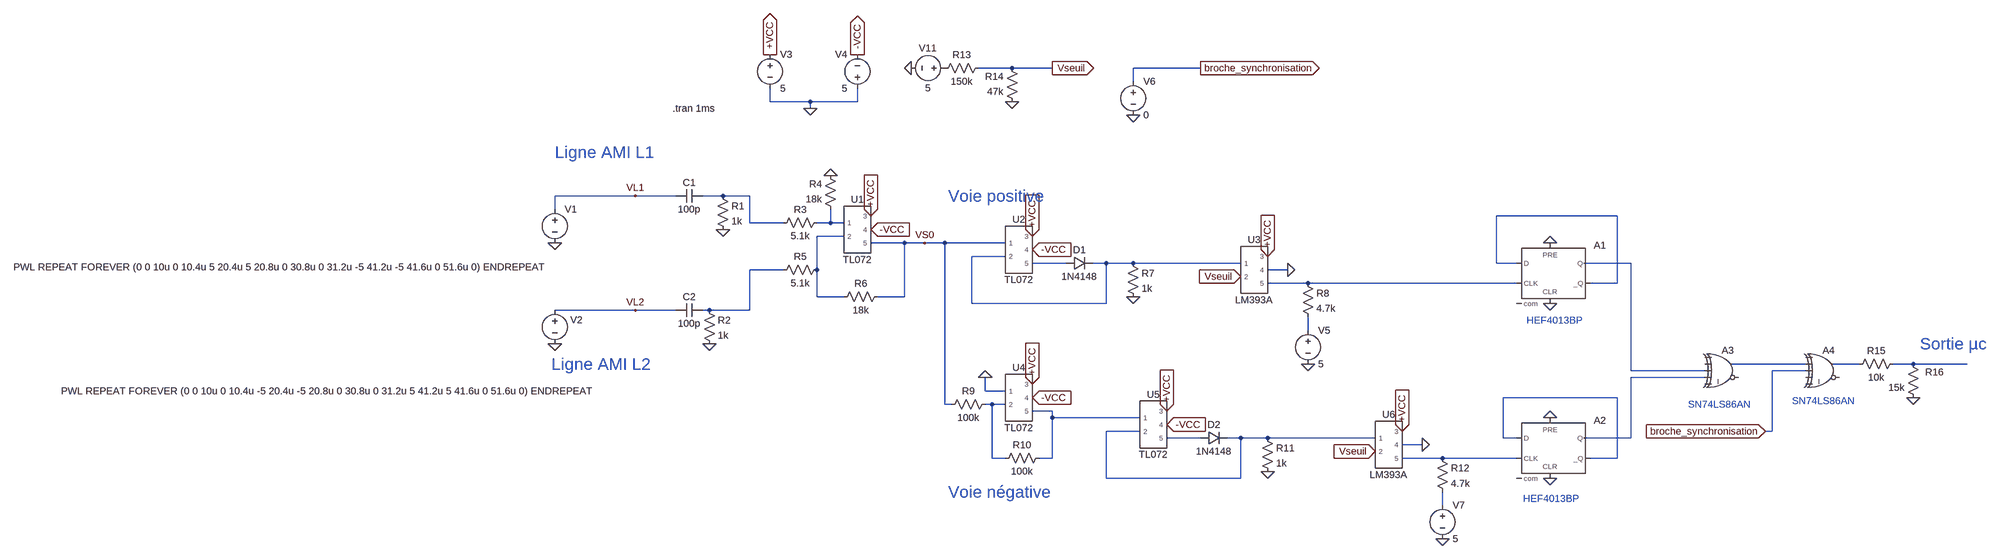
[diagram p0: schematic Recepteur_AMI_V5V_XOR.asc]
Recepteur_AMI_V5V_XOR.asc, the LTspice schematic file:
Version 4.1
SHEET 1 3440 908
WIRE 1024 -256 944 -256
WIRE 1120 -256 1024 -256
WIRE 1472 -256 1312 -256
WIRE 1312 -224 1312 -256
WIRE 448 -176 448 -208
WIRE 544 -176 448 -176
WIRE 656 -176 656 -208
WIRE 656 -176 544 -176
WIRE 544 -160 544 -176
WIRE 128 48 -64 48
WIRE 224 48 128 48
WIRE 336 48 288 48
WIRE 400 48 336 48
WIRE -64 80 -64 48
WIRE 2464 96 2176 96
WIRE 400 112 400 48
WIRE 480 112 400 112
WIRE 592 112 592 80
WIRE 592 112 560 112
WIRE 624 112 592 112
WIRE 624 144 560 144
WIRE 768 160 688 160
WIRE 816 160 768 160
WIRE 864 160 816 160
WIRE 1008 160 864 160
WIRE 1008 192 928 192
WIRE 1152 208 1072 208
WIRE 1248 208 1216 208
WIRE 1312 208 1248 208
WIRE 1568 208 1312 208
WIRE 2176 208 2176 96
WIRE 2224 208 2176 208
WIRE 2496 208 2384 208
WIRE 480 224 400 224
WIRE 560 224 560 144
WIRE 1680 224 1632 224
WIRE 1728 256 1632 256
WIRE 2224 256 1728 256
WIRE 2464 256 2464 96
WIRE 2464 256 2400 256
WIRE 560 288 560 224
WIRE 624 288 560 288
WIRE 768 288 768 160
WIRE 768 288 704 288
WIRE 928 304 928 192
WIRE 1248 304 1248 208
WIRE 1248 304 928 304
WIRE 128 320 -64 320
WIRE 224 320 128 320
WIRE 304 320 288 320
WIRE 400 320 400 224
WIRE 400 320 304 320
WIRE 1728 368 1728 336
WIRE 2912 448 2736 448
WIRE 3040 448 2976 448
WIRE 3168 448 3120 448
WIRE 3296 448 3168 448
WIRE 2496 464 2496 208
WIRE 2672 464 2496 464
WIRE 2912 464 2832 464
WIRE 2672 480 2496 480
WIRE 960 512 960 480
WIRE 1008 512 960 512
WIRE 2464 528 2192 528
WIRE 864 544 864 160
WIRE 880 544 864 544
WIRE 976 544 960 544
WIRE 1008 544 976 544
WIRE 1120 560 1072 560
WIRE 1120 576 1120 560
WIRE 1328 576 1120 576
WIRE 1328 608 1248 608
WIRE 2832 608 2832 464
WIRE 2832 608 2816 608
WIRE 1472 624 1392 624
WIRE 1568 624 1536 624
WIRE 1632 624 1568 624
WIRE 1888 624 1632 624
WIRE 2192 624 2192 528
WIRE 2224 624 2192 624
WIRE 2496 624 2496 480
WIRE 2496 624 2384 624
WIRE 2000 640 1952 640
WIRE 976 672 976 544
WIRE 1008 672 976 672
WIRE 1120 672 1120 576
WIRE 1120 672 1088 672
WIRE 2048 672 1952 672
WIRE 2224 672 2048 672
WIRE 2464 672 2464 528
WIRE 2464 672 2400 672
WIRE 1248 720 1248 608
WIRE 1568 720 1568 624
WIRE 1568 720 1248 720
WIRE 2048 784 2048 752
FLAG -64 160 0
FLAG -64 400 0
FLAG 336 128 0
FLAG 304 400 0
FLAG 544 -160 0
FLAG 448 -288 +VCC
IOPIN 448 -288 Out
FLAG 656 -288 -VCC
IOPIN 656 -288 Out
FLAG 688 96 +VCC
IOPIN 688 96 In
FLAG 688 128 -VCC
IOPIN 688 128 In
FLAG 592 0 0
FLAG 1072 144 +VCC
IOPIN 1072 144 In
FLAG 1072 176 -VCC
IOPIN 1072 176 In
FLAG 1312 288 0
FLAG 1728 448 0
FLAG 1632 192 +VCC
IOPIN 1632 192 In
FLAG 1680 224 0
FLAG 1072 496 +VCC
IOPIN 1072 496 In
FLAG 1072 528 -VCC
IOPIN 1072 528 In
FLAG 1392 560 +VCC
IOPIN 1392 560 In
FLAG 1392 592 -VCC
IOPIN 1392 592 In
FLAG 1632 704 0
FLAG 2048 864 0
FLAG 1952 608 +VCC
IOPIN 1952 608 In
FLAG 2000 640 0
FLAG 960 480 0
FLAG 2304 160 0
FLAG 2304 304 0
FLAG 2304 576 0
FLAG 2304 720 0
FLAG 816 160 VS0
FLAG 128 48 VL1
FLAG 128 320 VL2
FLAG 784 -256 0
FLAG 1120 -256 Vseuil
IOPIN 1120 -256 Out
FLAG 1568 240 Vseuil
IOPIN 1568 240 In
FLAG 1888 656 Vseuil
IOPIN 1888 656 In
FLAG 1024 -176 0
FLAG 3168 528 0
FLAG 1312 -144 0
FLAG 1472 -256 broche_synchronisation
IOPIN 1472 -256 Out
FLAG 2816 608 broche_synchronisation
IOPIN 2816 608 In
SYMBOL voltage -64 64 R0
WINDOW 3 -1288 153 Left 2
SYMATTR Value PWL REPEAT FOREVER (0 0 10u 0 10.4u 5 20.4u 5 20.8u 0 30.8u 0 31.2u -5 41.2u -5 41.6u 0 51.6u 0) ENDREPEAT
SYMATTR InstName V1
SYMBOL voltage -64 304 R0
WINDOW 0 37 39 Left 2
WINDOW 3 -1175 208 Left 2
SYMATTR InstName V2
SYMATTR Value PWL REPEAT FOREVER (0 0 10u 0 10.4u -5 20.4u -5 20.8u 0 30.8u 0 31.2u 5 41.2u 5 41.6u 0 51.6u 0) ENDREPEAT
SYMBOL TL072 656 128 R0
SYMATTR InstName U1
SYMBOL cap 288 32 R90
WINDOW 0 0 32 VBottom 2
WINDOW 3 32 32 VTop 2
SYMATTR InstName C1
SYMATTR Value 100p
SYMBOL res 320 32 R0
SYMATTR InstName R1
SYMATTR Value 1k
SYMBOL cap 288 304 R90
WINDOW 0 0 32 VBottom 2
WINDOW 3 32 32 VTop 2
SYMATTR InstName C2
SYMATTR Value 100p
SYMBOL res 288 304 R0
SYMATTR InstName R2
SYMATTR Value 1k
SYMBOL voltage 448 -304 R0
SYMATTR InstName V3
SYMATTR Value 5
SYMBOL voltage 656 -192 R180
WINDOW 0 24 96 Left 2
WINDOW 3 24 16 Left 2
SYMATTR InstName V4
SYMATTR Value 5
SYMBOL res 576 96 R90
WINDOW 0 0 56 VBottom 2
WINDOW 3 32 56 VTop 2
SYMATTR InstName R3
SYMATTR Value 5.1k
SYMBOL res 608 96 R180
WINDOW 0 36 76 Left 2
WINDOW 3 36 40 Left 2
SYMATTR InstName R4
SYMATTR Value 18k
SYMBOL res 464 240 R270
WINDOW 0 32 56 VTop 2
WINDOW 3 0 56 VBottom 2
SYMATTR InstName R5
SYMATTR Value 5.1k
SYMBOL res 608 304 R270
WINDOW 0 32 56 VTop 2
WINDOW 3 0 56 VBottom 2
SYMATTR InstName R6
SYMATTR Value 18k
SYMBOL TL072 1040 176 R0
SYMATTR InstName U2
SYMBOL diode 1152 224 R270
WINDOW 0 32 32 VTop 2
WINDOW 3 0 32 VBottom 2
SYMATTR InstName D1
SYMATTR Value 1N4148
SYMBOL res 1296 192 R0
SYMATTR InstName R7
SYMATTR Value 1k
SYMBOL LM393A 1600 224 R0
SYMATTR InstName U3
SYMBOL voltage 1728 352 R0
SYMATTR InstName V5
SYMATTR Value 5
SYMBOL res 1712 240 R0
SYMATTR InstName R8
SYMATTR Value 4.7k
SYMBOL TL072 1040 528 R0
SYMATTR InstName U4
SYMBOL res 976 528 R90
WINDOW 0 0 56 VBottom 2
WINDOW 3 32 56 VTop 2
SYMATTR InstName R9
SYMATTR Value 100k
SYMBOL TL072 1360 592 R0
SYMATTR InstName U5
SYMBOL diode 1472 640 R270
WINDOW 0 32 32 VTop 2
WINDOW 3 0 32 VBottom 2
SYMATTR InstName D2
SYMATTR Value 1N4148
SYMBOL res 1616 608 R0
SYMATTR InstName R11
SYMATTR Value 1k
SYMBOL LM393A 1920 640 R0
SYMATTR InstName U6
SYMBOL voltage 2048 768 R0
SYMATTR InstName V7
SYMATTR Value 5
SYMBOL res 2032 656 R0
SYMATTR InstName R12
SYMATTR Value 4.7k
SYMBOL Digital\\dflop 2304 160 R0
SYMATTR InstName A1
SYMBOL Digital\\dflop 2304 576 R0
SYMATTR InstName A2
SYMBOL Digital\\xor 2720 400 R0
SYMATTR InstName A3
SYMBOL res 1104 656 R90
WINDOW 0 0 56 VBottom 2
WINDOW 3 32 56 VTop 2
SYMATTR InstName R10
SYMATTR Value 100k
SYMBOL voltage 880 -256 R90
WINDOW 0 -32 56 VBottom 2
WINDOW 3 32 56 VTop 2
SYMATTR InstName V11
SYMATTR Value 5
SYMBOL res 960 -272 R90
WINDOW 0 0 56 VBottom 2
WINDOW 3 32 56 VTop 2
SYMATTR InstName R13
SYMATTR Value 150k
SYMBOL res 1040 -160 R180
WINDOW 0 36 76 Left 2
WINDOW 3 36 40 Left 2
SYMATTR InstName R14
SYMATTR Value 47k
SYMBOL res 3136 432 R90
WINDOW 0 0 56 VBottom 2
WINDOW 3 32 56 VTop 2
SYMATTR InstName R15
SYMATTR Value 10k
SYMBOL res 3184 544 R180
WINDOW 0 -57 77 Left 2
WINDOW 3 36 40 Left 2
SYMATTR InstName R16
SYMATTR Value 15k
SYMBOL voltage 1312 -240 R0
SYMATTR InstName V6
SYMATTR Value 0
SYMBOL Digital\\xor 2960 400 R0
WINDOW 3 -6 -52 Left 2
SYMATTR InstName A4
TEXT 216 -160 Left 2 !.tran 1ms
TEXT -64 -56 Left 4 ;Ligne AMI L1
TEXT -72 448 Left 4 ;Ligne AMI L2
TEXT 872 48 Left 4 ;Voie positive
TEXT 872 752 Left 4 ;Voie négative
TEXT 2248 344 Left 2 ;HEF4013BP
TEXT 2240 768 Left 2 ;HEF4013BP
TEXT 2632 544 Left 2 ;SN74LS86AN
TEXT 3184 400 Left 4 ;Sortie µc
TEXT 2880 536 Left 2 ;SN74LS86AN

The netlist it stands for:
* Recepteur_AMI_V5V_XOR.asc
V1 VL1 0 PWL REPEAT FOREVER (0 0 10u 0 10.4u 5 20.4u 5 20.8u 0 30.8u 0 31.2u -5 41.2u -5 41.6u 0 51.6u 0) ENDREPEAT
V2 VL2 0 PWL REPEAT FOREVER (0 0 10u 0 10.4u -5 20.4u -5 20.8u 0 30.8u 0 31.2u 5 41.2u 5 41.6u 0 51.6u 0) ENDREPEAT
X§U1 N003 N004 +VCC -VCC VS0 TL072  ; pins 1 2 3 4 5
C1 N001 VL1 100p
R1 N001 0 1k
C2 N008 VL2 100p
R2 N008 0 1k
V3 +VCC 0 5
V4 0 -VCC 5
R3 N003 N001 5.1k
R4 N003 0 18k
R5 N008 N004 5.1k
R6 N004 VS0 18k
X§U2 VS0 N005 +VCC -VCC N006 TL072  ; pins 1 2 3 4 5
D1 N006 N005 1N4148
R7 N005 0 1k
X§U3 N005 Vseuil +VCC 0 N009 LM393A  ; pins 1 2 3 4 5
V5 N010 0 5
R8 N009 N010 4.7k
X§U4 0 N016 +VCC -VCC N017 TL072  ; pins 1 2 3 4 5
R9 N016 VS0 100k
X§U5 N017 N018 +VCC -VCC N019 TL072  ; pins 1 2 3 4 5
D2 N019 N018 1N4148
R11 N018 0 1k
X§U6 N018 Vseuil +VCC 0 N020 LM393A  ; pins 1 2 3 4 5
V7 N021 0 5
R12 N020 N021 4.7k
A1 N002 0 N009 0 0 N002 N007 0 DFLOP
A2 N015 0 N020 0 0 N015 N014 0 DFLOP
A3 0 0 N007 N014 0 0 N011 0 XOR
R10 N017 N016 100k
V11 P001 0 5
R13 Vseuil P001 150k
R14 0 Vseuil 47k
R15 N013 N012 10k
R16 0 N013 15k
V6 broche_synchronisation 0 0
A4 0 N011 broche_synchronisation 0 0 0 N012 0 XOR
.model D D
.lib standard.dio
.tran 1ms
* Ligne AMI L1
* Ligne AMI L2
* Voie positive
* Voie négative
* HEF4013BP
* HEF4013BP
* SN74LS86AN
* Sortie µc
* SN74LS86AN
.lib D:\M2 SME\test\TL072.301
.lib D:\M2 SME\test\LM393A.5_1
.backanno
.end